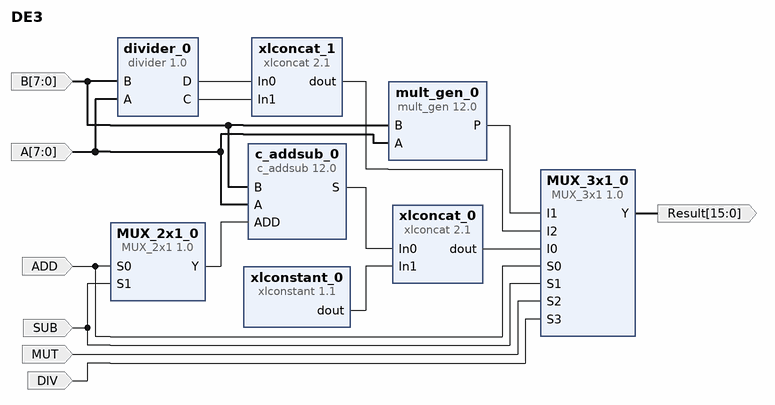
[diagram p0: block diagram of the top level]
# Vivado block design DE3, xc7a35tcpg236-1, Vivado 2020.2
create_bd_design DE3

create_bd_port -dir I -from 7 -to 0 A
create_bd_port -dir I -from 7 -to 0 B
create_bd_port -dir I ADD
create_bd_port -dir I SUB
create_bd_port -dir I MUT
create_bd_port -dir I DIV
create_bd_port -dir O -from 15 -to 0 Result

create_bd_cell -type ip -vlnv xilinx.com:ip:c_addsub:12.0 c_addsub_0
set_property -dict [list \
  CONFIG.A_Type Unsigned \
  CONFIG.A_Width 8 \
  CONFIG.Add_Mode Add_Subtract \
  CONFIG.B_Type Unsigned \
  CONFIG.B_Value 00000000 \
  CONFIG.B_Width 8 \
  CONFIG.CE false \
  CONFIG.Latency 0 \
  CONFIG.Out_Width 8 \
] [get_bd_cells c_addsub_0]
create_bd_cell -type ip -vlnv xilinx.com:user:MUX_3x1:1.0 MUX_3x1_0
create_bd_cell -type ip -vlnv xilinx.com:user:MUX_2x1:1.0 MUX_2x1_0
create_bd_cell -type ip -vlnv xilinx.com:ip:xlconcat:2.1 xlconcat_0
set_property -dict {CONFIG.IN0_WIDTH 8 CONFIG.IN1_WIDTH 8} [get_bd_cells xlconcat_0]
create_bd_cell -type ip -vlnv xilinx.com:ip:xlconcat:2.1 xlconcat_1
set_property -dict {CONFIG.IN0_WIDTH 8 CONFIG.IN1_WIDTH 8} [get_bd_cells xlconcat_1]
create_bd_cell -type ip -vlnv xilinx.com:ip:xlconstant:1.1 xlconstant_0
set_property -dict {CONFIG.CONST_VAL 0 CONFIG.CONST_WIDTH 8} [get_bd_cells xlconstant_0]
create_bd_cell -type ip -vlnv xilinx.com:ip:mult_gen:12.0 mult_gen_0
set_property -dict [list \
  CONFIG.PipeStages 0 \
  CONFIG.PortAType Unsigned \
  CONFIG.PortAWidth 8 \
  CONFIG.PortBType Unsigned \
  CONFIG.PortBWidth 8 \
] [get_bd_cells mult_gen_0]
create_bd_cell -type ip -vlnv xilinx.com:user:divider:1.0 divider_0

# ---- connections ----

connect_bd_net [get_bd_pins xlconstant_0/dout] [get_bd_pins xlconcat_0/In1]
connect_bd_net [get_bd_pins c_addsub_0/S] [get_bd_pins xlconcat_0/In0]
connect_bd_net [get_bd_pins xlconcat_0/dout] [get_bd_pins MUX_3x1_0/I0]
connect_bd_net [get_bd_pins xlconcat_1/dout] [get_bd_pins MUX_3x1_0/I2]
connect_bd_net [get_bd_pins divider_0/D] [get_bd_pins xlconcat_1/In0]
connect_bd_net [get_bd_pins divider_0/C] [get_bd_pins xlconcat_1/In1]
connect_bd_net [get_bd_pins MUX_2x1_0/Y] [get_bd_pins c_addsub_0/ADD]
connect_bd_net [get_bd_pins mult_gen_0/P] [get_bd_pins MUX_3x1_0/I1]
connect_bd_net [get_bd_ports B] [get_bd_pins c_addsub_0/B] [get_bd_pins mult_gen_0/B] [get_bd_pins divider_0/B]
connect_bd_net [get_bd_ports A] [get_bd_pins c_addsub_0/A] [get_bd_pins mult_gen_0/A] [get_bd_pins divider_0/A]
connect_bd_net [get_bd_ports ADD] [get_bd_pins MUX_2x1_0/S0] [get_bd_pins MUX_3x1_0/S0]
connect_bd_net [get_bd_ports SUB] [get_bd_pins MUX_2x1_0/S1] [get_bd_pins MUX_3x1_0/S1]
connect_bd_net [get_bd_ports MUT] [get_bd_pins MUX_3x1_0/S2]
connect_bd_net [get_bd_ports DIV] [get_bd_pins MUX_3x1_0/S3]
connect_bd_net [get_bd_pins MUX_3x1_0/Y] [get_bd_ports Result]

validate_bd_design
save_bd_design
